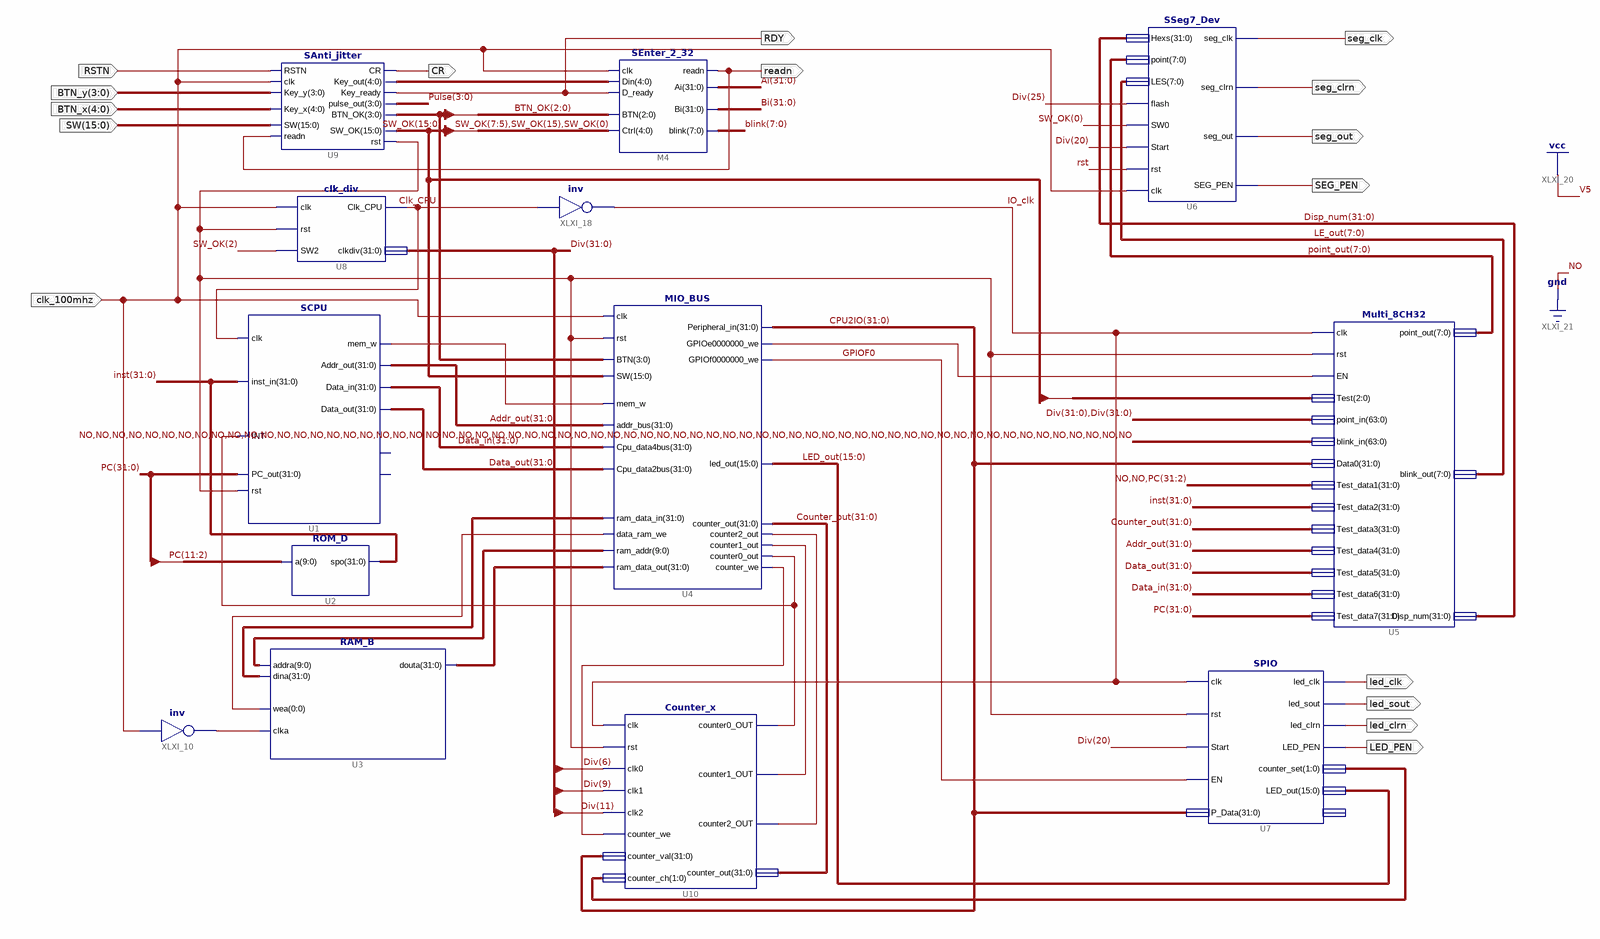
[diagram p0: schematic sheet 1]
// Xilinx ISE schematic Top.sch (kintex7) as structural Verilog: 13 symbols, 16 ports
module Top (
  input  [3:0] BTN_y,
  input  [4:0] BTN_x,
  input  [15:0] SW,
  input  RSTN,
  input  clk_100mhz,
  output CR,
  output RDY,
  output readn,
  output seg_clrn,
  output seg_out,
  output SEG_PEN,
  output led_clk,
  output led_sout,
  output led_clrn,
  output LED_PEN,
  output seg_clk
);

  wire Clk_CPU, GPIOF0, IO_clk, rst, XLXN_82, XLXN_89, XLXN_120, XLXN_133, XLXN_134, XLXN_137, XLXN_186,
       XLXN_314;
  wire [0:0] XLXN_227;
  wire [1:0] XLXN_151;
  wire [3:0] BTN_OK, Pulse;
  wire [4:0] XLXN_2;
  wire [7:0] blink, LE_out, point_out;
  wire [9:0] XLXN_115;
  wire [15:0] LED_out, SW_OK;
  wire [31:0] Addr_out, Ai, Bi, Counter_out, CPU2IO, Data_in, Data_out, Disp_num, Div, inst, PC, XLXN_109,
       XLXN_116;

  clk_div U8 (.clk(clk_100mhz), .rst(XLXN_186), .SW2(SW_OK[2]), .Clk_CPU(Clk_CPU), .clkdiv(Div));
  SEnter_2_32 M4 (
    .readn(readn), .Ai(Ai), .Bi(Bi), .blink(blink), .Din(XLXN_2), .D_ready(RDY), .clk(clk_100mhz),
    .Ctrl({SW_OK[7:5], SW_OK[15], SW_OK[0]}), .BTN(BTN_OK[2:0]));
  SSeg7_Dev U6 (
    .Hexs(Disp_num), .point(point_out), .LES(LE_out), .flash(Div[25]), .SW0(SW_OK[0]), .Start(Div[20]),
    .rst(rst), .clk(clk_100mhz), .seg_clk(seg_clk), .seg_clrn(seg_clrn), .seg_out(seg_out), .SEG_PEN(SEG_PEN));
  not XLXI_18 (IO_clk, Clk_CPU);
  SPIO U7 (
    .clk(IO_clk), .rst(XLXN_186), .Start(Div[20]), .EN(GPIOF0), .P_Data(CPU2IO), .led_clk(led_clk),
    .led_sout(led_sout), .led_clrn(led_clrn), .LED_PEN(LED_PEN), .counter_set(XLXN_151), .LED_out(LED_out));  // open: GPIOf0
  ROM_D U2 (.a(PC[11:2]), .spo(inst));
  MIO_BUS U4 (
    .rst(XLXN_186), .clk(clk_100mhz), .mem_w(XLXN_89), .addr_bus(Addr_out), .Cpu_data4bus(Data_in),
    .Cpu_data2bus(Data_out), .ram_data_out(XLXN_116), .ram_addr(XLXN_115), .data_ram_we(XLXN_227[0]),
    .ram_data_in(XLXN_109), .counter_out(Counter_out), .counter2_out(XLXN_137), .counter1_out(XLXN_134),
    .counter0_out(XLXN_120), .counter_we(XLXN_133), .BTN(BTN_OK), .SW(SW_OK), .led_out(LED_out),
    .Peripheral_in(CPU2IO), .GPIOe0000000_we(XLXN_314), .GPIOf0000000_we(GPIOF0));
  Counter_x U10 (
    .clk(IO_clk), .rst(XLXN_186), .clk0(Div[6]), .clk1(Div[9]), .clk2(Div[11]), .counter_we(XLXN_133),
    .counter_val(CPU2IO), .counter_ch(XLXN_151), .counter0_OUT(XLXN_120), .counter1_OUT(XLXN_134),
    .counter2_OUT(XLXN_137), .counter_out(Counter_out));
  RAM_B U3 (.addra(XLXN_115), .dina(XLXN_109), .wea(XLXN_227[0]), .clka(XLXN_82), .douta(XLXN_116));
  Multi_8CH32 U5 (
    .clk(IO_clk), .rst(XLXN_186), .EN(XLXN_314), .Test(SW_OK[2:0]), .point_in({Div, Div}),
    .blink_in({64{1'b0}}), .Data0(CPU2IO), .Test_data1({2'b00, PC[31:2]}), .Test_data2(inst),
    .Test_data3(Counter_out), .Test_data4(Addr_out), .Test_data5(Data_out), .Test_data6(Data_in),
    .Test_data7(PC), .point_out(point_out), .blink_out(LE_out), .Disp_num(Disp_num));
  SCPU U1 (
    .clk(Clk_CPU), .Data_in(Data_in), .inst_in(inst), .INT(XLXN_120), .Data_out(Data_out),
    .Addr_out(Addr_out), .PC_out(PC), .mem_w(XLXN_89), .rst(XLXN_186));  // open: MIO_ready, CPU_MIO
  not XLXI_10 (XLXN_82, clk_100mhz);
  SAnti_jitter U9 (
    .SW(SW), .readn(readn), .Key_y(BTN_y), .Key_x(BTN_x), .RSTN(RSTN), .clk(clk_100mhz), .Key_out(XLXN_2),
    .Key_ready(RDY), .CR(CR), .rst(XLXN_186), .SW_OK(SW_OK), .pulse_out(Pulse), .BTN_OK(BTN_OK));
endmodule
